# EAGLE design ORCA_STLINK_MICRO_DEBUG_8_PIN_UART_TOP (EAGLE 9.7.0)
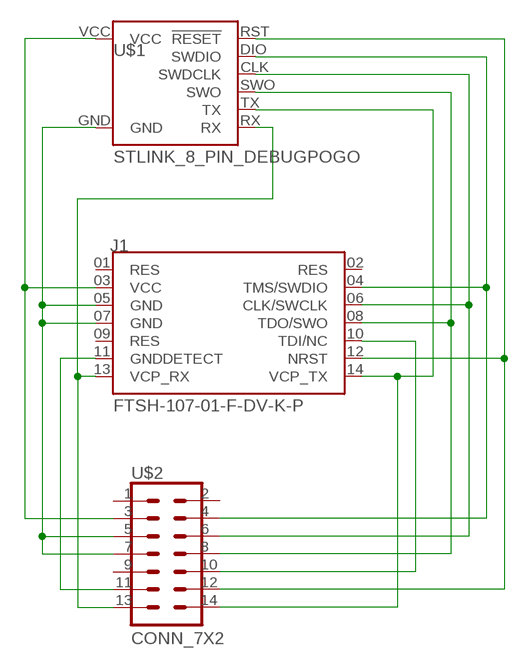
[diagram p0: schematic, sheet 1]

## Parts
J1  FTSH-107-01-F-DV-K-P  [SAMTEC_FTSH-107-01-F-DV-K-P]
U$1  STLINK_8_PIN_DEBUGPOGO  [STLINK_8_PIN_POGO]
U$2  CONN_7X2  [2X07]

## Nets
!RST: J1.12(NRST) U$1.RST(!RESET) U$2.12
CLK: J1.06(CLK/SWCLK) U$1.CLK(SWDCLK) U$2.6
DIO: J1.04(TMS/SWDIO) U$1.DIO(SWDIO) U$2.4
GND: J1.05(GND) J1.07(GND) U$1.GND U$2.5 U$2.7
GND_DETECT: J1.11(GNDDETECT) U$2.11
SWO: J1.08(TDO/SWO) U$1.SWO U$2.8
TDI: J1.10(TDI/NC) U$2.10
VCC: J1.03(VCC) U$1.VCC U$2.3
VCP_RX: J1.13(VCP_RX) U$1.RX U$2.13
VCP_TX: J1.14(VCP_TX) U$1.TX U$2.14
Unconnected: J1.01(RES) J1.02(RES) J1.09(RES) U$2.1 U$2.2 U$2.9

## Library data of the parts
J1 = _L_Communication:FTSH-107-01-F-DV-K-P; MANUFACTURER: Samtec; PARTREV: R; STANDARD: Manufacturer Recommendations
U$1 = _L_Communication:STLINK_8_PIN_DEBUG
U$2 = _L_Connectors:CONN_7X2

## Board
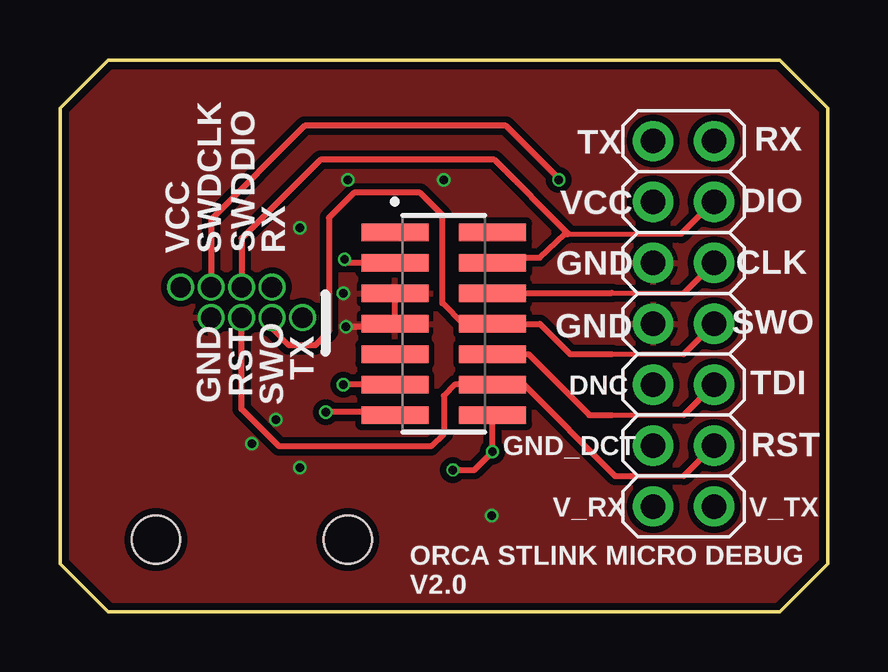
[diagram p1: board, top side]
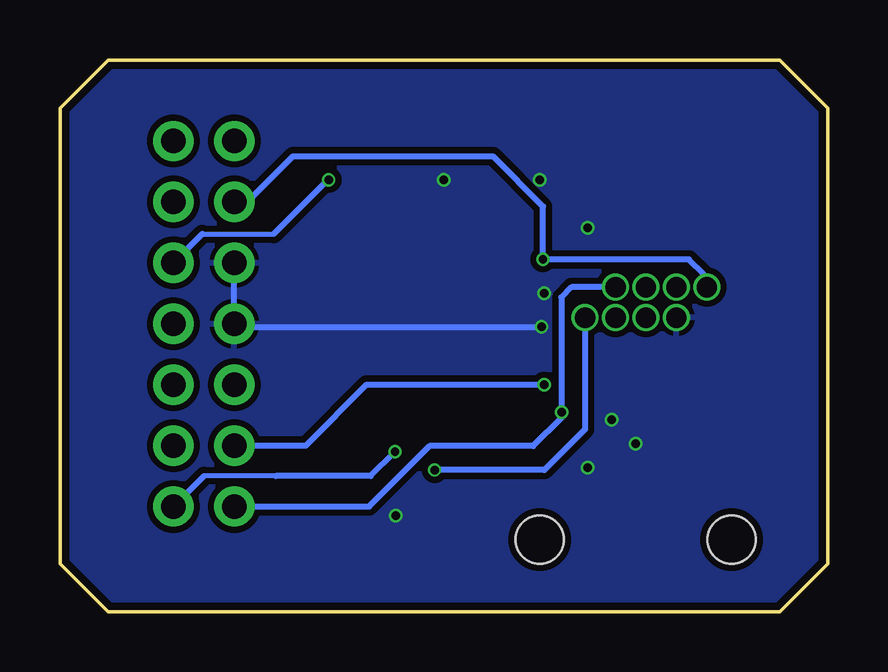
[diagram p2: board, bottom side, seen from below]

Size 32 x 23 mm. Coordinates in mm from the lower left corner, seen from the top.
Outline: 2,0 30,0 32,2 32,21 30,23 2,23 0,21 0,2 2,0
Copper layers (1*16): Top 0.035mm / dielectric 1.5mm / Bottom 0.035mm
Design rules "PCBWay_2L_100um-Track *": minimum track width 0.1mm, minimum drill 0.3mm, track to track 0.1mm, track to pad 0.1mm, pad to pad 0.1mm, via to via 0.1mm, smd to smd 0mil, copper to edge 0.3mm, drill to drill 10mil, minimum pad ring 0.13mm, minimum via ring 0.1mm, stop-mask expansion 2mil, vias tented up to drill 0.45mm, thermal gap 0.2mm
Holes 2 mm at 12,3 4,3

### Footprints (pad centres in the part's own frame; a part is rotated, then mirrored left to right if it is on the bottom)
SAMTEC_FTSH-107-01-F-DV-K-P = smd 0.74 x 2.79: 01 -3.81,-2.035; 02 -3.81,2.035; 03 -2.54,-2.035; 04 -2.54,2.035; 05 -1.27,-2.035; 06 -1.27,2.035; 07 0,-2.035; 08 0,2.035; 09 1.27,-2.035; 10 1.27,2.035; 11 2.54,-2.035; 12 2.54,2.035; 13 3.81,-2.035; 14 3.81,2.035
STLINK_8_PIN_POGO = drill 0.85 pad 1.12 slot 0.85 rotated 90: CLK -1.27,1.27; DIO 0,1.27; GND -1.27,0; RST 0,0; RX 1.27,1.27; SWO 1.27,0; TX 2.54,0; VCC -2.54,1.27
2X07 = drill 1.016 pad 1.676: 1 -7.62,-1.27; 2 -7.62,1.27; 3 -5.08,-1.27; 4 -5.08,1.27; 5 -2.54,-1.27; 6 -2.54,1.27; 7 0,-1.27; 8 0,1.27; 9 2.54,-1.27; 10 2.54,1.27; 11 5.08,-1.27; 12 5.08,1.27; 13 7.62,-1.27; 14 7.62,1.27

### Placement (x,y rotation side)
J1  16,12 270 top
U$1  7.57,12.25 0 top
U$2  26,12 270 top

### Tracks (layer width: path | path; a pad name or v marks a point on that pad's centre or on a via)
!RST
  Top 0.2: 24,5.65 26,5.65
  Top 0.254: U$1.RST 7.57,8.44 9.13,6.89 15.48,6.89 16,7.41 16,9 16.46,9.46 J1.12 19.34,9.46 23.14,5.65 24,5.65 | U$2.12 26,5.65
CLK  (via drill 0.35)
  Top 0.2: 23,13.28 26.01,13.28
  Top 0.254: U$1.CLK 6.3,16.35 10.21,20.26 18.6,20.26 20.8,18.05 v20.8,18 | U$2.6 26.01,13.28 | J1.06 18.05,13.28 23,13.28
  Bottom 0.2: 26.06,15.75 23.09,15.75
  Bottom 0.254: U$2.6 26.06,15.75 | 23.09,15.75 20.83,18 v20.8,18
DIO
  Top 0.2: 21.2,15.75 25.89,15.75
  Top 0.254: U$2.4 27.22,17.08 25.89,15.75 | J1.04 18.25,14.75 20.01,14.75 21.06,15.75 21.2,15.75 18.11,18.84 10.86,18.84 7.57,15.56 U$1.DIO
GND  (via drill 0.35)
  Top 0.254: v11.92,11.87 13.84,11.87 J1.07 J1.05
  Bottom 0.254: 11.92,11.86 v11.92,11.87 24.6,11.87 U$2.7 U$2.5
  other vias: 9,8 11.81,13.27 10,6 8,7 10,16 12,18 16,18 18,4
  pour Top (isolate 0.254): -1.87,-2.87 35.87,-2.87 35.87,23.87 -1.87,23.87
  pour Bottom (isolate 0.254): -2.87,-1.87 34.87,-1.87 34.87,24.87 -2.87,24.87
GND_DETECT  (via drill 0.35)
  Top 0.254: J1.11 v11.81,9.46
  Bottom 0.254: U$2.11 21.75,6.92 19.21,9.46 v11.81,9.46
SWO
  Top 0.2: 23,10.73 26,10.73
  Top 0.254: U$1.SWO 8.84,11.79 9.54,11.1 10.64,11.1 11.22,11.68 11.22,16.42 12.26,17.46 15.02,17.46 15.94,16.54 15.94,12.86 16.8,12 J1.08 20,12 21.27,10.73 23,10.73 | 26,10.73 U$2.8
TDI
  Top 0.2: 23,8.19 26,8.19
  Top 0.254: J1.10 19.53,10.73 22.07,8.19 23,8.19 | 26,8.19 U$2.10
VCC  (via drill 0.35)
  Top 0.254: J1.03 12.01,14.54 v11.86,14.69
  Bottom 0.254: U$1.VCC 5.16,13.65 5.16,14.07 5.78,14.69 v11.86,14.69 11.86,16.89 13.95,18.98 22.29,18.98 24.19,17.08 U$2.3
VCP_RX  (via drill 0.35)
  Top 0.254: J1.13 13.84,8.32 v11.08,8.32
  Bottom 0.254: U$2.13 19.11,4.38 16.59,6.9 12.27,6.9 11.08,8.09 v11.08,8.32 11.1,8.33 11.1,13.1 10.67,13.52 U$1.RX
VCP_TX  (via drill 0.35)
  Top 0.254: J1.14 v18.04,6.67 v18.03,6.67 17.27,5.9 v16.38,5.9
  Bottom 0.2: 23,5.65 26,5.65
  Bottom 0.254: U$2.14 26,5.65 | v18.03,6.67 19.05,5.65 23,5.65 | U$1.TX 10.11,7.6 11.81,5.9 v16.38,5.9

### Text on the board
tNames: TX | RX | DIO | VCC | VCC | SWDCLK | SWDDIO | RX | CLK | GND | SWO | GND | TX | GND | RST | SWO | DNC | TDI | GND_DCT | RST | V_RX | V_TX | ORCA STLINK MICRO DEBUG / V2.0